# Altium schematic sheet main.SchDoc
size B
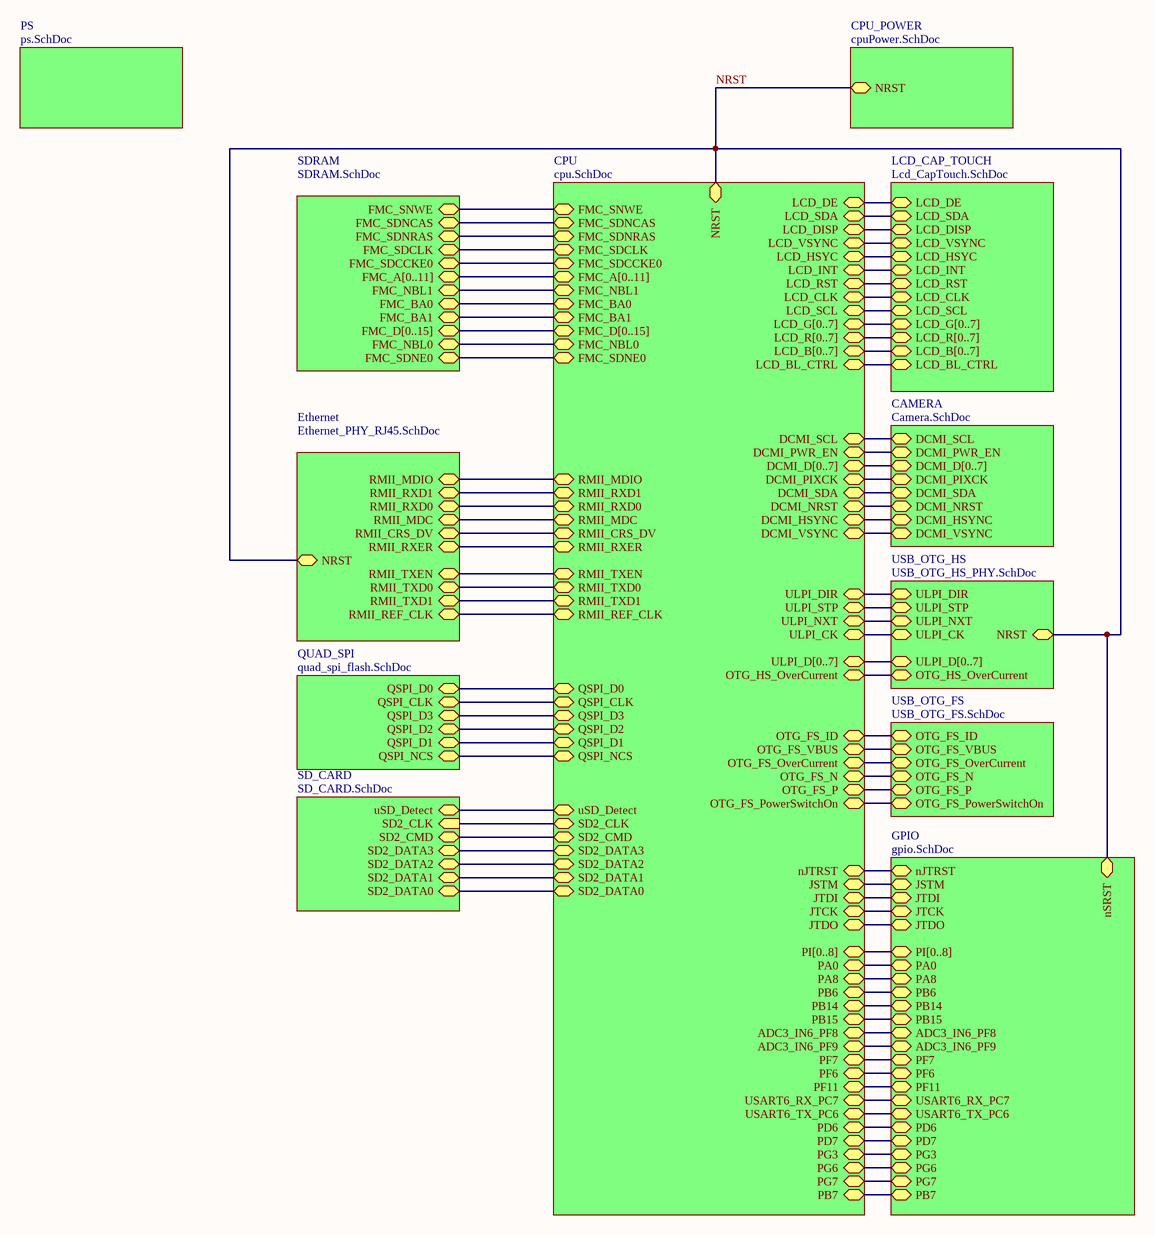
[diagram p0: main.SchDoc]

## Sub-sheets
CAMERA = Camera.SchDoc: DCMI_SCL (bidir), DCMI_PWR_EN (bidir), DCMI_D[0..7] (bidir), DCMI_PIXCK (bidir), DCMI_SDA (bidir), DCMI_NRST (bidir), DCMI_HSYNC (bidir), DCMI_VSYNC (bidir)
CPU = cpu.SchDoc: FMC_SDNRAS (bidir), FMC_SNWE (bidir), FMC_NBL0 (bidir), FMC_SDCCKE0 (bidir), FMC_SDCLK (bidir), FMC_SDNCAS (bidir), FMC_SDNE0 (bidir), FMC_NBL1 (bidir), FMC_BA1 (bidir), FMC_BA0 (bidir), FMC_A[0..11] (bidir), FMC_D[0..15] (bidir), RMII_MDC (bidir), RMII_RXD0 (bidir), RMII_RXER (bidir), RMII_CRS_DV (bidir), RMII_RXD1 (bidir), RMII_MDIO (bidir), RMII_TXEN (bidir), RMII_TXD0 (bidir), RMII_TXD1 (bidir), RMII_REF_CLK (bidir), QSPI_D0 (bidir), QSPI_NCS (bidir), QSPI_D1 (bidir), QSPI_CLK (bidir), QSPI_D3 (bidir), QSPI_D2 (bidir), SD2_CLK (bidir), SD2_CMD (bidir), uSD_Detect (bidir), SD2_DATA3 (bidir), SD2_DATA2 (bidir), SD2_DATA1 (bidir), SD2_DATA0 (bidir), LCD_B[0..7] (bidir), LCD_VSYNC (bidir), LCD_DE (bidir), LCD_R[0..7] (bidir), LCD_G[0..7] (bidir), LCD_DISP (bidir), LCD_RST (bidir), LCD_SCL (bidir), LCD_SDA (bidir), LCD_INT (bidir), LCD_CLK (bidir), LCD_HSYC (bidir), LCD_BL_CTRL (bidir), DCMI_SCL (bidir), DCMI_NRST (bidir), DCMI_PWR_EN (bidir), DCMI_SDA (bidir), DCMI_VSYNC (bidir), DCMI_HSYNC (bidir), DCMI_PIXCK (bidir), DCMI_D[0..7] (bidir), ULPI_CK (bidir), ULPI_NXT (bidir), OTG_HS_OverCurrent (bidir), ULPI_D[0..7] (bidir), ULPI_DIR (bidir), ULPI_STP (bidir), OTG_FS_P (bidir), OTG_FS_VBUS (bidir), OTG_FS_OverCurrent (bidir), OTG_FS_PowerSwitchOn (bidir), OTG_FS_N (bidir), OTG_FS_ID (bidir), NRST (bidir), PA8 (bidir), PF7 (bidir), ADC3_IN6_PF8 (bidir), USART6_RX_PC7 (bidir), USART6_TX_PC6 (bidir), PD6 (bidir), PD7 (bidir), PB14 (bidir), PB15 (bidir), PB6 (bidir), PI[0..8] (bidir), PG3 (bidir), PG6 (bidir), PG7 (bidir), PF6 (bidir), PF11 (bidir), ADC3_IN6_PF9 (bidir), PA0 (bidir), JTCK (bidir), JSTM (bidir), JTDO (bidir), nJTRST (bidir), JTDI (bidir), PB7 (bidir)
CPU_POWER = cpuPower.SchDoc: NRST (bidir)
Ethernet = Ethernet_PHY_RJ45.SchDoc: RMII_MDIO (bidir), RMII_RXD1 (bidir), RMII_RXD0 (bidir), RMII_MDC (bidir), RMII_CRS_DV (bidir), RMII_RXER (bidir), NRST (bidir), RMII_TXEN (bidir), RMII_TXD0 (bidir), RMII_TXD1 (bidir), RMII_REF_CLK (bidir)
GPIO = gpio.SchDoc: PG3 (bidir), PF11 (bidir), USART6_RX_PC7 (bidir), PF6 (bidir), PG7 (bidir), ADC3_IN6_PF8 (bidir), JTDI (bidir), nJTRST (bidir), JSTM (bidir), PD7 (bidir), PB15 (bidir), PF7 (bidir), PB14 (bidir), PI[0..8] (bidir), USART6_TX_PC6 (bidir), PB6 (bidir), JTCK (bidir), PA0 (bidir), PG6 (bidir), PD6 (bidir), ADC3_IN6_PF9 (bidir), JTDO (bidir), PA8 (bidir), nSRST (bidir), PB7 (bidir)
LCD_CAP_TOUCH = Lcd_CapTouch.SchDoc: LCD_B[0..7] (bidir), LCD_DE (bidir), LCD_SDA (bidir), LCD_DISP (bidir), LCD_R[0..7] (bidir), LCD_SCL (bidir), LCD_INT (bidir), LCD_RST (bidir), LCD_HSYC (bidir), LCD_CLK (bidir), LCD_VSYNC (bidir), LCD_G[0..7] (bidir), LCD_BL_CTRL (bidir)
PS = ps.SchDoc: no entries
QUAD_SPI = quad_spi_flash.SchDoc: QSPI_D0 (bidir), QSPI_CLK (bidir), QSPI_D3 (bidir), QSPI_D2 (bidir), QSPI_D1 (bidir), QSPI_NCS (bidir)
SD_CARD = SD_CARD.SchDoc: uSD_Detect (bidir), SD2_CLK (in), SD2_CMD (bidir), SD2_DATA3 (bidir), SD2_DATA2 (bidir), SD2_DATA1 (bidir), SD2_DATA0 (bidir)
SDRAM = SDRAM.SchDoc: FMC_SNWE (bidir), FMC_SDNCAS (bidir), FMC_SDNRAS (bidir), FMC_SDCLK (bidir), FMC_SDCCKE0 (bidir), FMC_A[0..11] (bidir), FMC_NBL1 (bidir), FMC_BA0 (bidir), FMC_BA1 (bidir), FMC_D[0..15] (bidir), FMC_NBL0 (bidir), FMC_SDNE0 (bidir)
USB_OTG_FS = USB_OTG_FS.SchDoc: OTG_FS_ID (bidir), OTG_FS_VBUS (bidir), OTG_FS_OverCurrent (bidir), OTG_FS_N (bidir), OTG_FS_P (bidir), OTG_FS_PowerSwitchOn (bidir)
USB_OTG_HS = USB_OTG_HS_PHY.SchDoc: ULPI_DIR (bidir), ULPI_STP (bidir), ULPI_NXT (bidir), ULPI_CK (bidir), NRST (bidir), ULPI_D[0..7] (bidir), OTG_HS_OverCurrent (bidir)

## Nets
NRST: sheet CPU/NRST, sheet Ethernet/NRST, sheet CPU_POWER/NRST, sheet USB_OTG_HS/NRST, sheet GPIO/nSRST
(unnamed): sheet CPU/FMC_SDNRAS, sheet SDRAM/FMC_SDNRAS
(unnamed): sheet CPU/FMC_SNWE, sheet SDRAM/FMC_SNWE
(unnamed): sheet CPU/FMC_NBL0, sheet SDRAM/FMC_NBL0
(unnamed): sheet CPU/FMC_SDCCKE0, sheet SDRAM/FMC_SDCCKE0
(unnamed): sheet CPU/FMC_SDCLK, sheet SDRAM/FMC_SDCLK
(unnamed): sheet CPU/FMC_SDNCAS, sheet SDRAM/FMC_SDNCAS
(unnamed): sheet CPU/FMC_SDNE0, sheet SDRAM/FMC_SDNE0
(unnamed): sheet CPU/FMC_NBL1, sheet SDRAM/FMC_NBL1
(unnamed): sheet CPU/FMC_BA1, sheet SDRAM/FMC_BA1
(unnamed): sheet CPU/FMC_BA0, sheet SDRAM/FMC_BA0
(unnamed): sheet CPU/RMII_MDC, sheet Ethernet/RMII_MDC
(unnamed): sheet CPU/RMII_RXD0, sheet Ethernet/RMII_RXD0
(unnamed): sheet CPU/RMII_RXER, sheet Ethernet/RMII_RXER
(unnamed): sheet CPU/RMII_CRS_DV, sheet Ethernet/RMII_CRS_DV
(unnamed): sheet CPU/RMII_RXD1, sheet Ethernet/RMII_RXD1
(unnamed): sheet CPU/RMII_MDIO, sheet Ethernet/RMII_MDIO
(unnamed): sheet CPU/RMII_TXEN, sheet Ethernet/RMII_TXEN
(unnamed): sheet CPU/RMII_TXD0, sheet Ethernet/RMII_TXD0
(unnamed): sheet CPU/RMII_TXD1, sheet Ethernet/RMII_TXD1
(unnamed): sheet CPU/RMII_REF_CLK, sheet Ethernet/RMII_REF_CLK
(unnamed): sheet CPU/QSPI_D0, sheet QUAD_SPI/QSPI_D0
(unnamed): sheet CPU/QSPI_NCS, sheet QUAD_SPI/QSPI_NCS
(unnamed): sheet CPU/QSPI_D1, sheet QUAD_SPI/QSPI_D1
(unnamed): sheet CPU/QSPI_CLK, sheet QUAD_SPI/QSPI_CLK
(unnamed): sheet CPU/QSPI_D3, sheet QUAD_SPI/QSPI_D3
(unnamed): sheet CPU/QSPI_D2, sheet QUAD_SPI/QSPI_D2
(unnamed): sheet CPU/SD2_CLK, sheet SD_CARD/SD2_CLK
(unnamed): sheet CPU/SD2_CMD, sheet SD_CARD/SD2_CMD
(unnamed): sheet CPU/uSD_Detect, sheet SD_CARD/uSD_Detect
(unnamed): sheet CPU/SD2_DATA3, sheet SD_CARD/SD2_DATA3
(unnamed): sheet CPU/SD2_DATA2, sheet SD_CARD/SD2_DATA2
(unnamed): sheet CPU/SD2_DATA1, sheet SD_CARD/SD2_DATA1
(unnamed): sheet CPU/SD2_DATA0, sheet SD_CARD/SD2_DATA0
(unnamed): sheet CPU/LCD_VSYNC, sheet LCD_CAP_TOUCH/LCD_VSYNC
(unnamed): sheet CPU/LCD_DE, sheet LCD_CAP_TOUCH/LCD_DE
(unnamed): sheet CPU/LCD_DISP, sheet LCD_CAP_TOUCH/LCD_DISP
(unnamed): sheet CPU/LCD_RST, sheet LCD_CAP_TOUCH/LCD_RST
(unnamed): sheet CPU/LCD_SCL, sheet LCD_CAP_TOUCH/LCD_SCL
(unnamed): sheet CPU/LCD_SDA, sheet LCD_CAP_TOUCH/LCD_SDA
(unnamed): sheet CPU/LCD_INT, sheet LCD_CAP_TOUCH/LCD_INT
(unnamed): sheet CPU/LCD_CLK, sheet LCD_CAP_TOUCH/LCD_CLK
(unnamed): sheet CPU/LCD_HSYC, sheet LCD_CAP_TOUCH/LCD_HSYC
(unnamed): sheet CPU/LCD_BL_CTRL, sheet LCD_CAP_TOUCH/LCD_BL_CTRL
(unnamed): sheet CPU/DCMI_SCL, sheet CAMERA/DCMI_SCL
(unnamed): sheet CPU/DCMI_NRST, sheet CAMERA/DCMI_NRST
(unnamed): sheet CPU/DCMI_PWR_EN, sheet CAMERA/DCMI_PWR_EN
(unnamed): sheet CPU/DCMI_SDA, sheet CAMERA/DCMI_SDA
(unnamed): sheet CPU/DCMI_VSYNC, sheet CAMERA/DCMI_VSYNC
(unnamed): sheet CPU/DCMI_HSYNC, sheet CAMERA/DCMI_HSYNC
(unnamed): sheet CPU/DCMI_PIXCK, sheet CAMERA/DCMI_PIXCK
(unnamed): sheet CPU/ULPI_CK, sheet USB_OTG_HS/ULPI_CK
(unnamed): sheet CPU/ULPI_NXT, sheet USB_OTG_HS/ULPI_NXT
(unnamed): sheet CPU/OTG_HS_OverCurrent, sheet USB_OTG_HS/OTG_HS_OverCurrent
(unnamed): sheet CPU/ULPI_DIR, sheet USB_OTG_HS/ULPI_DIR
(unnamed): sheet CPU/ULPI_STP, sheet USB_OTG_HS/ULPI_STP
(unnamed): sheet CPU/OTG_FS_P, sheet USB_OTG_FS/OTG_FS_P
(unnamed): sheet CPU/OTG_FS_VBUS, sheet USB_OTG_FS/OTG_FS_VBUS
(unnamed): sheet CPU/OTG_FS_OverCurrent, sheet USB_OTG_FS/OTG_FS_OverCurrent
(unnamed): sheet CPU/OTG_FS_PowerSwitchOn, sheet USB_OTG_FS/OTG_FS_PowerSwitchOn
(unnamed): sheet CPU/OTG_FS_N, sheet USB_OTG_FS/OTG_FS_N
(unnamed): sheet CPU/OTG_FS_ID, sheet USB_OTG_FS/OTG_FS_ID
(unnamed): sheet CPU/PA8, sheet GPIO/PA8
(unnamed): sheet CPU/PF7, sheet GPIO/PF7
(unnamed): sheet CPU/ADC3_IN6_PF8, sheet GPIO/ADC3_IN6_PF8
(unnamed): sheet CPU/USART6_RX_PC7, sheet GPIO/USART6_RX_PC7
(unnamed): sheet CPU/USART6_TX_PC6, sheet GPIO/USART6_TX_PC6
(unnamed): sheet CPU/PD6, sheet GPIO/PD6
(unnamed): sheet CPU/PD7, sheet GPIO/PD7
(unnamed): sheet CPU/PB14, sheet GPIO/PB14
(unnamed): sheet CPU/PB15, sheet GPIO/PB15
(unnamed): sheet CPU/PB6, sheet GPIO/PB6
(unnamed): sheet CPU/PG3, sheet GPIO/PG3
(unnamed): sheet CPU/PG6, sheet GPIO/PG6
(unnamed): sheet CPU/PG7, sheet GPIO/PG7
(unnamed): sheet CPU/PF6, sheet GPIO/PF6
(unnamed): sheet CPU/PF11, sheet GPIO/PF11
(unnamed): sheet CPU/ADC3_IN6_PF9, sheet GPIO/ADC3_IN6_PF9
(unnamed): sheet CPU/PA0, sheet GPIO/PA0
(unnamed): sheet CPU/JTCK, sheet GPIO/JTCK
(unnamed): sheet CPU/JSTM, sheet GPIO/JSTM
(unnamed): sheet CPU/JTDO, sheet GPIO/JTDO
(unnamed): sheet CPU/nJTRST, sheet GPIO/nJTRST
(unnamed): sheet CPU/JTDI, sheet GPIO/JTDI
(unnamed): sheet CPU/PB7, sheet GPIO/PB7

## Buses and harness runs
bus sheet CAMERA/DCMI_D[0..7] = sheet CPU/DCMI_D[0..7]
bus sheet CPU/FMC_A[0..11] = sheet SDRAM/FMC_A[0..11]
bus sheet CPU/FMC_D[0..15] = sheet SDRAM/FMC_D[0..15]
bus sheet CPU/LCD_B[0..7] = sheet LCD_CAP_TOUCH/LCD_B[0..7]
bus sheet CPU/LCD_G[0..7] = sheet LCD_CAP_TOUCH/LCD_G[0..7]
bus sheet CPU/LCD_R[0..7] = sheet LCD_CAP_TOUCH/LCD_R[0..7]
bus sheet CPU/PI[0..8] = sheet GPIO/PI[0..8]
bus sheet CPU/ULPI_D[0..7] = sheet USB_OTG_HS/ULPI_D[0..7]